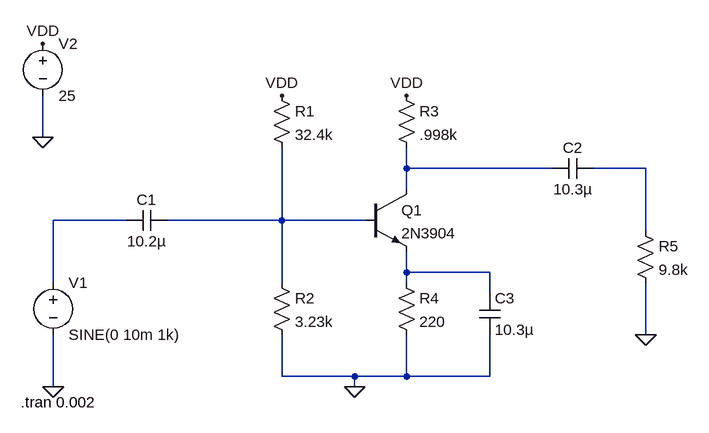
[diagram p0: schematic npn_2n3904_amplifier.asc]
npn_2n3904_amplifier.asc, the LTspice schematic file:
Version 4
SHEET 1 880 680
WIRE -352 32 -352 -32
WIRE 208 80 208 48
WIRE 432 80 208 80
WIRE 576 80 496 80
WIRE 208 112 208 80
WIRE -224 160 -336 160
WIRE 16 160 16 48
WIRE 16 160 -160 160
WIRE 144 160 16 160
WIRE 576 176 576 80
WIRE 208 240 208 208
WIRE 336 240 208 240
WIRE -336 256 -336 160
WIRE 16 256 16 160
WIRE 208 256 208 240
WIRE 336 272 336 240
WIRE 576 336 576 256
WIRE 16 400 16 336
WIRE 128 400 16 400
WIRE 208 400 208 336
WIRE 208 400 128 400
WIRE 336 400 336 336
WIRE 336 400 208 400
WIRE -336 416 -336 336
WIRE 128 416 128 400
FLAG 128 416 0
FLAG -336 416 0
FLAG -352 32 0
FLAG 576 336 0
FLAG -352 -112 VDD
FLAG 16 -32 VDD
FLAG 208 -32 VDD
SYMBOL npn 144 112 R0
SYMATTR InstName Q1
SYMATTR Value 2N3904
SYMBOL res 0 -48 R0
SYMATTR InstName R1
SYMATTR Value 32.4k
SYMBOL res 0 240 R0
SYMATTR InstName R2
SYMATTR Value 3.23k
SYMBOL res 192 -48 R0
SYMATTR InstName R3
SYMATTR Value .998k
SYMBOL res 192 240 R0
SYMATTR InstName R4
SYMATTR Value 220
SYMBOL res 560 160 R0
SYMATTR InstName R5
SYMATTR Value 9.8k
SYMBOL cap -160 144 R90
WINDOW 0 0 32 VBottom 2
WINDOW 3 32 32 VTop 2
SYMATTR InstName C1
SYMATTR Value 10.2µ
SYMBOL voltage -336 240 R0
WINDOW 123 0 0 Left 0
WINDOW 39 0 0 Left 0
SYMATTR InstName V1
SYMATTR Value SINE(0 10m 1k)
SYMBOL voltage -352 -128 R0
WINDOW 123 0 0 Left 0
WINDOW 39 0 0 Left 0
SYMATTR InstName V2
SYMATTR Value 25
SYMBOL cap 496 64 R90
WINDOW 0 0 32 VBottom 2
WINDOW 3 32 32 VTop 2
SYMATTR InstName C2
SYMATTR Value 10.3µ
SYMBOL cap 320 272 R0
SYMATTR InstName C3
SYMATTR Value 10.3µ
TEXT -386 440 Left 2 !.tran 0.002

The netlist it stands for:
* npn_2n3904_amplifier.asc
Q1 N001 N004 N005 0 2N3904
R1 VDD N004 32.4k
R2 N004 0 3.23k
R3 VDD N001 .998k
R4 N005 0 220
R5 N002 0 9.8k
C1 N004 N003 10.2µ
V1 N003 0 SINE(0 10m 1k)
V2 VDD 0 25
C2 N002 N001 10.3µ
C3 N005 0 10.3µ
.model NPN NPN
.model PNP PNP
.lib standard.bjt
.tran 0.002
.backanno
.end